# EAGLE design wiringshield2 (EAGLE 5.11)
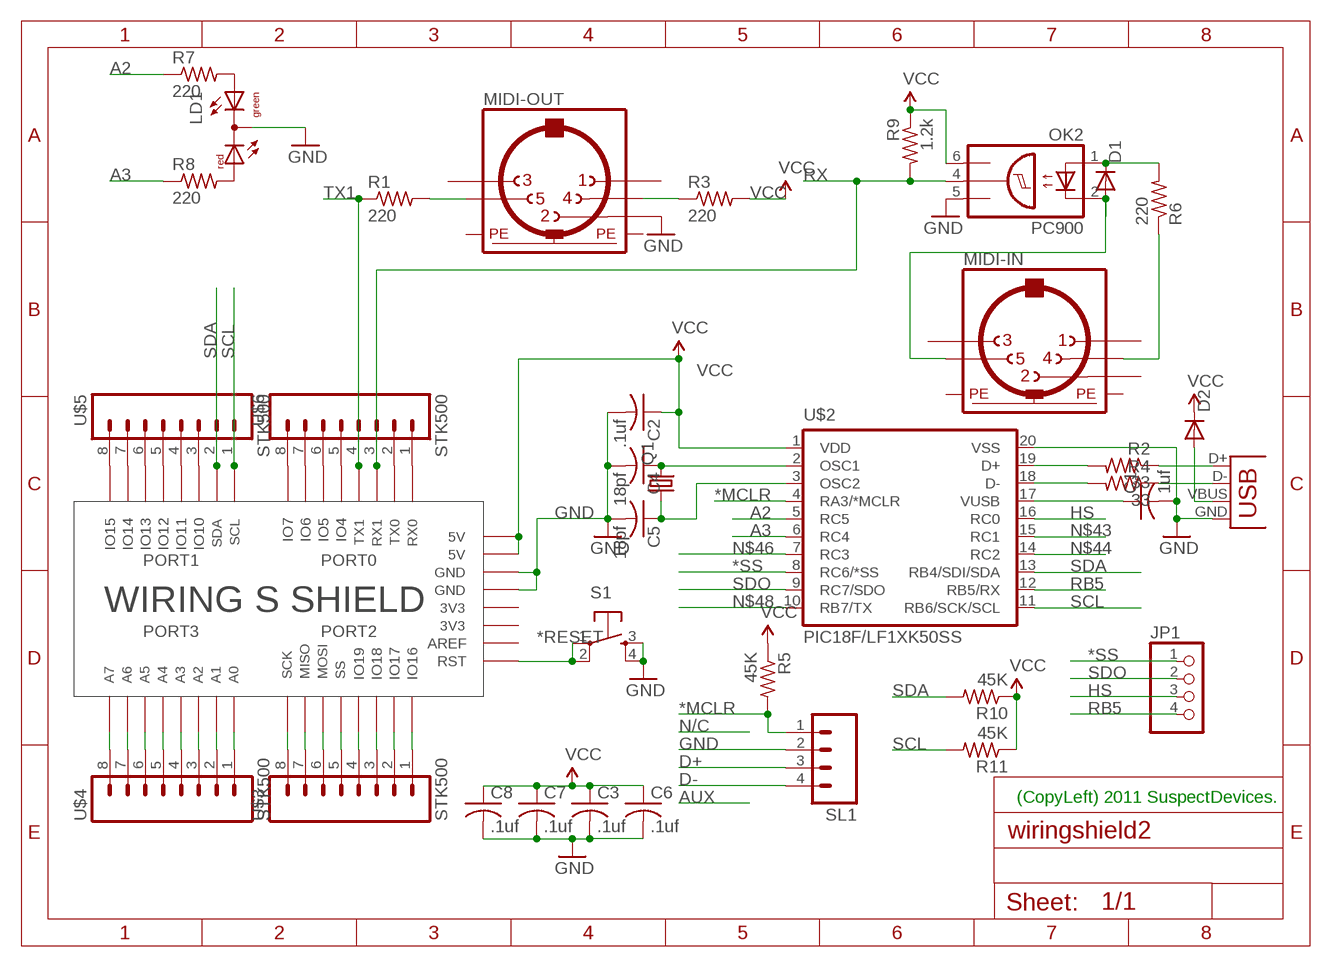
[diagram p0: schematic, sheet 1]

## Parts
C1  1uf  C-USC0603  [C0603]
C2  .1uf  C-USC0603  [C0603]
C3  .1uf  C-USC0603  [C0603]
C4  18pf  C-USC0603  [C0603]
C5  18pf  C-USC0603  [C0603]
C6  .1uf  C-USC0603  [C0603]
C7  .1uf  C-USC0603  [C0603]
C8  .1uf  C-USC0603  [C0603]
D1  DIODEPTH2  [DOIDE-1N4148]
D2  DIODEPTH2  [DOIDE-1N4148]
JP1  PINHD-1X4  [1X04]
LD1  DUOLED-RG-C  [DUOLED-C-5MM]
MIDI-IN  MAB5SH  [MAB5SH]
MIDI-OUT  MAB5SH  [MAB5SH]
OK2  PC900  OPI8013  [DIL06]
Q1  CRYSTALHC49S  [HC49/S]
R1  220  R-US_R0603  [R0603]
R2  33  R-US_R0603  [R0603]
R3  220  R-US_R0603  [R0603]
R4  33  R-US_R0603  [R0603]
R5  45K  R-US_R0603  [R0603]
R6  220  R-US_R0603  [R0603]
R7  220  R-US_R0603  [R0603]
R8  220  R-US_R0603  [R0603]
R9  1.2k  R-US_R0603  [R0603]
R10  45K  R-US_R0603  [R0603]
R11  45K  R-US_R0603  [R0603]
S1  TAC_SWITCHPTH  [TACTILE-PTH]
SL1  M04  [04P]
U$1  WIRINGSHIELD  [WIRINGSHIELD]
U$2  PIC18F/LF1XK50SS  [SSOP20]
U$3  STK500  [2X5-SHROUDED]
U$4  STK500  [2X5-SHROUDED]
U$5  STK500  [2X5-SHROUDED]
U$6  STK500  [2X5-SHROUDED]
X3  USB-3DPTH  [USB-B-PTH]

## Nets
*MCLR: R5.2 SL1.1 U$2.4(RA3/*MCLR)
*RESET: S1.1 S1.2 U$1.P$40(RST)
*SS: JP1.1 U$2.8(RC6/*SS)
A2: R7.1 U$2.5(RC5)
A3: R8.1 U$2.6(RC4)
D+: R2.2 SL1.3 U$2.19(D+)
D-: R4.2 SL1.4 U$2.18(D-)
GND [vcc]: C1.2 C2.2 C3.2 C4.2 C5.2 C6.2 C7.2 C8.2 LD1.C MIDI-OUT.2 OK2.5(GND) S1.3 S1.4 SL1.2 U$1.P$35(GND) U$1.P$36(GND) U$2.20(VSS) X3.GND
HS: JP1.3 U$2.16(RC0)
N$1: MIDI-OUT.5 R1.2
N$2: MIDI-OUT.4 R3.1
N$3: C1.1 U$2.17(VUSB)
N$4: U$1.P$17(IO16) U$3.1
N$5: U$1.P$18(IO17) U$3.2
N$6: LD1.AX(AG) R7.2
N$7: R2.1 X3.D+
N$8: R4.1 X3.D-
N$9: D2.A X3.VBUS
N$10: D1.C OK2.1(A) R6.2
N$11: U$1.P$19(IO18) U$3.3
N$12: U$1.P$20(IO19) U$3.4
N$13: U$1.P$21(IO20) U$3.5
N$14: C4.1 Q1.2 U$2.2(OSC1)
N$15: C5.1 Q1.1 U$2.3(OSC2)
N$16: MIDI-IN.4 R6.1
N$17: D1.A MIDI-IN.5 OK2.2(C)
N$19: U$1.P$22(IO21) U$3.6
N$20: U$1.P$23(IO22) U$3.7
N$21: U$1.P$24(IO23) U$3.8
N$22: U$1.P$25(IO24) U$4.1
N$23: U$1.P$26(IO25) U$4.2
N$24: U$1.P$27(IO26) U$4.3
N$25: U$1.P$28(IO27) U$4.4
N$26: U$1.P$29(IO28) U$4.5
N$27: U$1.P$30(IO29) U$4.6
N$28: U$1.P$31(IO30) U$4.7
N$29: U$1.P$32(IO31) U$4.8
N$30: LD1.AR R8.2
N$31: U$1.P$11(IO10) U$5.3
N$32: U$1.P$12(IO11) U$5.4
N$33: U$1.P$13(IO12) U$5.5
N$34: U$1.P$14(IO13) U$5.6
N$35: U$1.P$15(IO14) U$5.7
N$36: U$1.P$16(IO15) U$5.8
N$37: U$1.P$1(IO0) U$6.1
N$38: U$1.P$2(IO1) U$6.2
N$39: U$1.P$5(IO4) U$6.5
N$40: U$1.P$6(IO5) U$6.6
N$41: U$1.P$7(IO6) U$6.7
N$42: U$1.P$8(IO7) U$6.8
N$43: U$2.15(RC1)
N$44: U$2.14(RC2)
N$46: U$2.7(RC3)
N$48: U$2.10(RB7/TX)
RB5: JP1.4 U$2.12(RB5/RX)
RX: OK2.4(OUT) R9.2 U$1.P$3(IO2) U$6.3
SCL: R11.2 U$1.P$9(IO8) U$2.11(RB6/SCK/SCL) U$5.1
SDA: R10.2 U$1.P$10(IO9) U$2.13(RB4/SDI/SDA) U$5.2
SDO: JP1.2 U$2.9(RC7/SDO)
TX1: R1.1 U$1.P$4(IO3) U$6.4
VCC: C2.1 C3.1 C6.1 C7.1 C8.1 D2.C OK2.6(VCC) R3.2 R5.1 R9.1 R10.1 R11.1 U$1.P$33(5V) U$1.P$34(5V) U$2.1(VDD)
Unconnected: MIDI-IN.1 MIDI-IN.2 MIDI-IN.3 MIDI-IN.PE MIDI-IN.PE@(PE) MIDI-OUT.1 MIDI-OUT.3 MIDI-OUT.PE MIDI-OUT.PE@(PE) U$1.P$39(AREF)

## Notes on the sheet
- (CopyLeft) 2011 SuspectDevices.

## Power pins joined to a net without a drawn wire
3V3: U$1.P$37(3V3) U$1.P$38(3V3)
GND: U$3.9(GND) U$4.9(GND) U$5.9(GND) U$6.9(GND)
VCC: U$3.10(VCC) U$4.10(VCC) U$5.10(VCC) U$6.10(VCC)

## Library data of the parts
C1-C8 = rcl:C-US: CAPACITOR, American symbol
D1 D2 = 3d:DIODE: Diode These are standard reverse protection diodes and small signal diodes. SMA package can handle up to about 1A. SOD-323 can handle about 200mA. What the SOD-323 package when ordering, there are some mfgs out there that are 5-pin packages.
JP1 = 3d2011:PINHD-1X4: PIN HEADER
LD1 = led:DUOLED-RG-C: DUO LED 2 colors (red/green), 5 mm, round, common Cathode www.ligitek.com or other producers.
MIDI-IN MIDI-OUT = 3d2010:MAB5SH: Female CONNECTOR 5 pins 90 deg. with shield, horizontal (DIN 41524)
OK2 = optocoupler:OPI8013: OPTO COUPLER; OC_FARNELL: unknown; OC_NEWARK: unknown
Q1 = crystal:CRYSTAL: CRYSTAL; OC_FARNELL: 1667008; OC_NEWARK: unknown
R1 R3 R5 R7 R8 R10 R11 = resistor:R-US_: RESISTOR, American symbol
R2 R4 R6 R9 = rcl:R-US_: RESISTOR, American symbol
S1 = 3d2011:TAC_SWITCH: Momentary Switch Button commonly used for reset or general input. Spark Fun Electronics SKU : COM-00097
SL1 = con-amp-quick:M04: AMP QUICK CONNECTOR; OC_FARNELL: unknown; OC_NEWARK: unknown
U$1 = 3d2011:WIRINGSHIELD: Wiring S Shield
U$2 = mcp2200plus:PIC18F/LF1XK50: 20 pin USB flash Microcontroller.
U$3-U$6 = 3d2011:STK500
X3 = 3d2010:USB-3D: USB Connectors USB-B-PTH is fully proven SKU : PRT-00139 USB-miniB is fully proven SKU : PRT-00587 USB-A-PCB is untested. USB-A-H is throughly reviewed, but untested. Spark Fun Electronics SKU : PRT-00437 USB-B-SMT is throughly reviewed, but untested. Needs silkscreen touching up. USB-A-S has not been used/tested USB-MB-H has not been used/tested

## Net classes
0 default: width 0.203 mm
1 vcc: width 0.254 mm

## Board
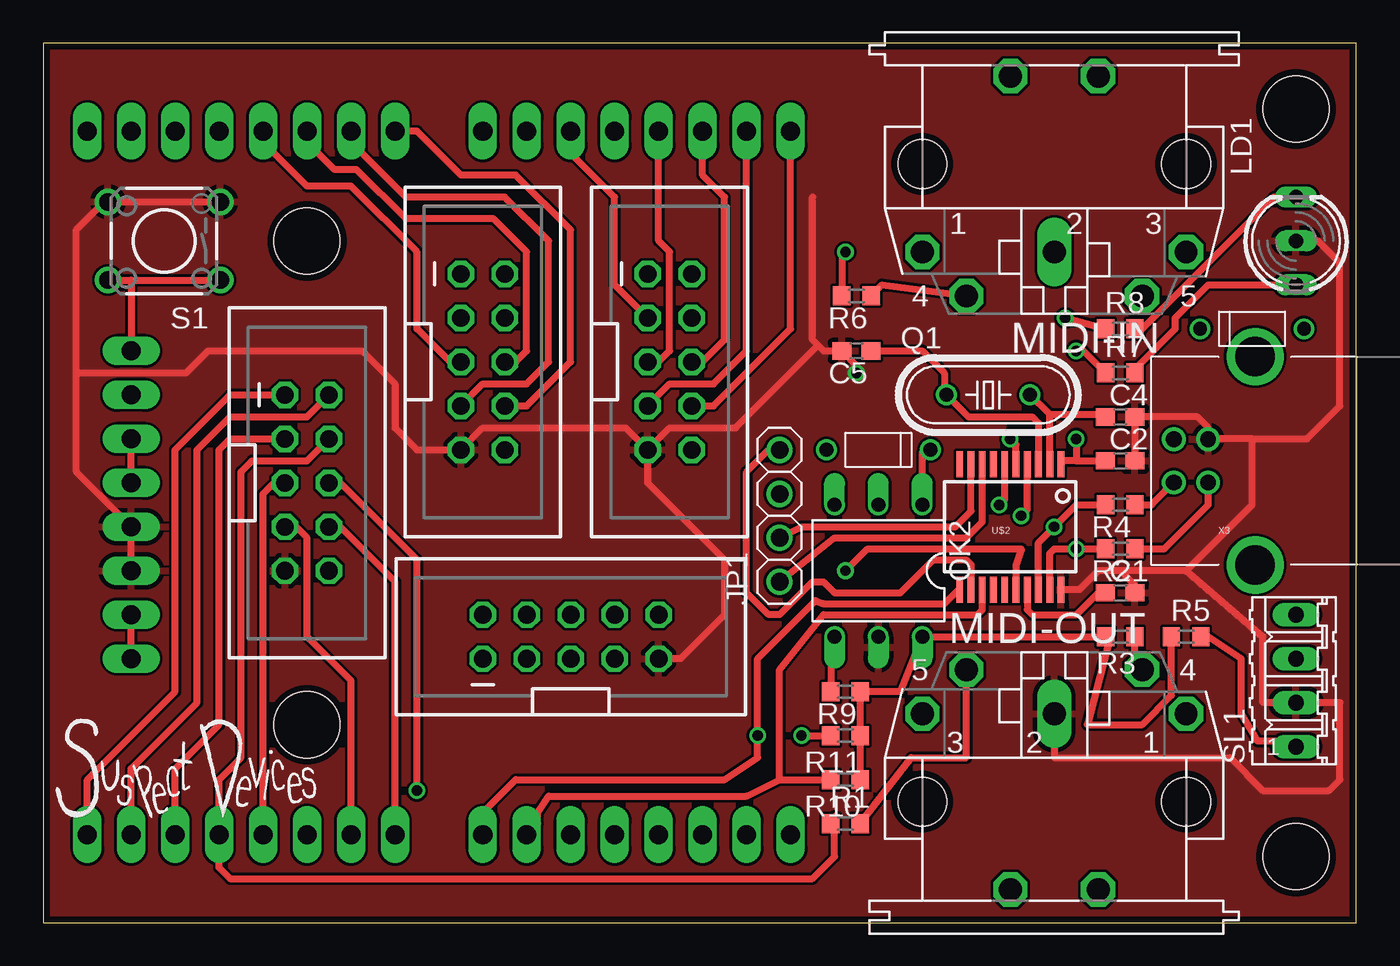
[diagram p1: board, top side]
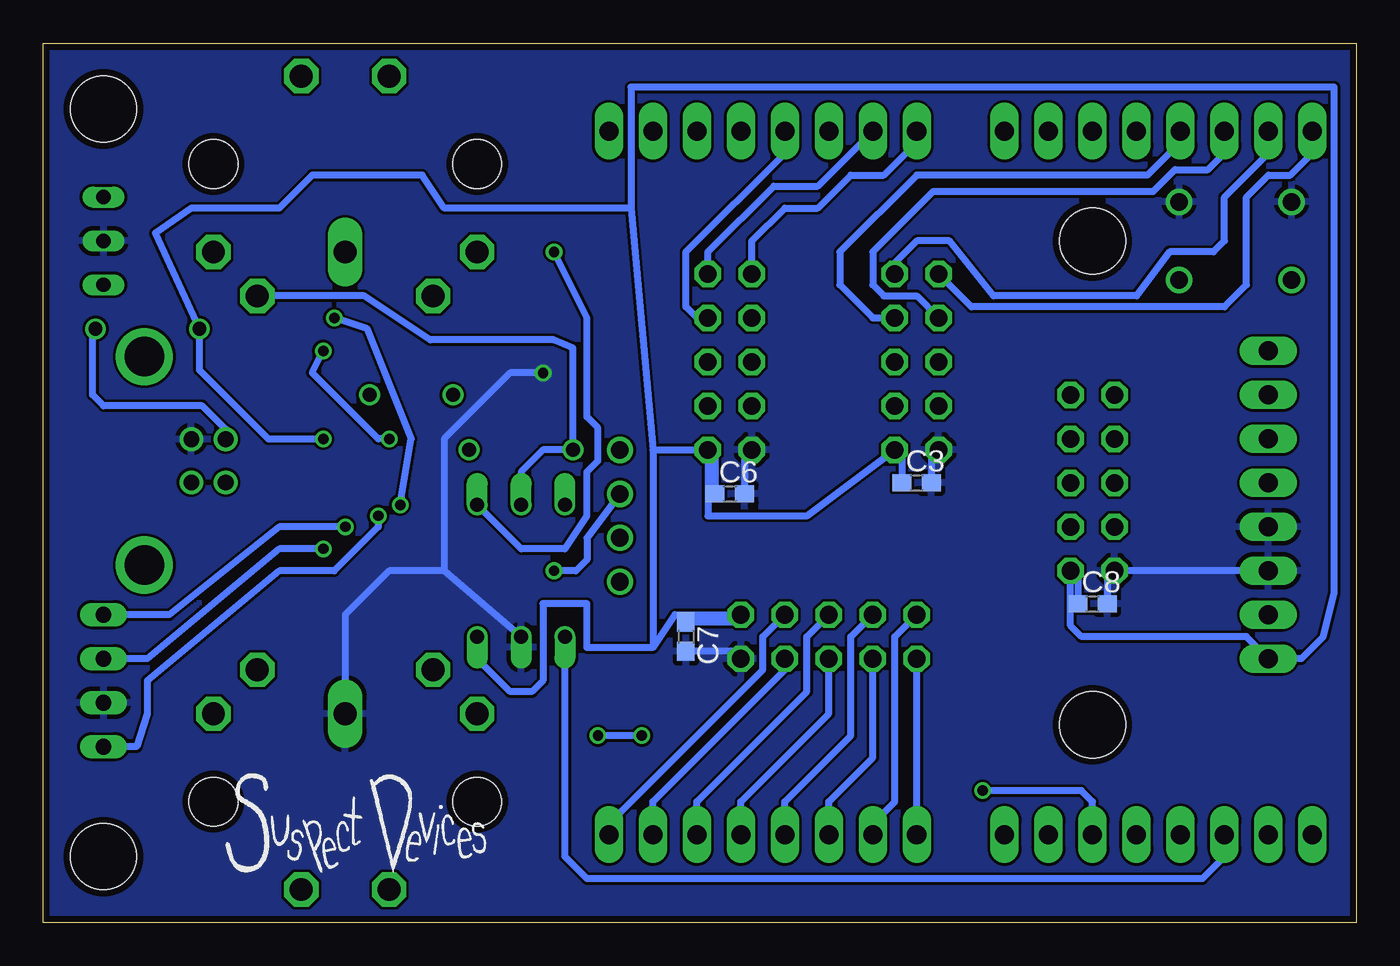
[diagram p2: board, bottom side, seen from below]

Size 75.87 x 50.79 mm. Coordinates in mm from the lower left corner, seen from the top.
Outline: 0,0 75.87,0 75.87,50.79 0,50.79 0,0
Copper layers (1*16): Top 0.0356mm / dielectric 1.5011mm / Bottom 0.0356mm
Design rules "LaenPCBOrder": minimum track width 6mil, minimum drill 13mil, track to track 6mil, track to pad 6mil, pad to pad 6mil, via to via 6mil, smd to smd 6mil, copper to edge 15mil, drill to drill 6mil, minimum pad ring 7mil, minimum via ring 7mil, stop-mask expansion 4mil, vias tented up to drill 0mil, thermal gap 10mil

### Footprints (pad centres in the part's own frame; a part is rotated, then mirrored left to right if it is on the bottom)
C0603 = smd 1.1 x 1: 1 -0.85,0; 2 0.85,0
DOIDE-1N4148 = drill 0.8 round: A 3,0; C -3,0
1X04 = drill 1.016 round: 1 -3.81,0; 2 -1.27,0; 3 1.27,0; 4 3.81,0
DUOLED-C-5MM = drill 0.813 long: AR 2.54,0; AX -2.54,0; C 0,0
MAB5SH = drill 1.321 octagon: 1 7.62,5.08; 3 -7.62,5.08; 4 5.08,7.62; 5 -5.08,7.62; PE -2.54,-5.08; PE@ 2.54,-5.08 | drill 1.321 long: 2 0,5.08 | hole 2.794: 7.62,0; -7.62,0
DIL06 = drill 0.813 offset: 1 -2.54,-3.81; 2 0,-3.81; 3 2.54,-3.81; 4 2.54,3.81; 5 0,3.81; 6 -2.54,3.81
HC49/S = drill 0.813 round: 1 -2.413,0; 2 2.413,0
R0603 = smd 1 x 1.1: 1 -0.85,0; 2 0.85,0
TACTILE-PTH = drill 1.016 round: 1 -3.251,2.261; 2 3.251,2.261; 3 -3.251,-2.261; 4 3.251,-2.261
04P = drill 0.914 long: 1 -3.81,0; 2 -1.27,0; 3 1.27,0; 4 3.81,0
WIRINGSHIELD = drill 1.1 pad 1.422 long: P$1 2.54,5.08; P$2 5.08,5.08; P$3 7.62,5.08; P$4 10.16,5.08; P$5 12.7,5.08; P$6 15.24,5.08; P$7 17.78,5.08; P$8 20.32,5.08; P$9 25.4,5.08; P$10 27.94,5.08; P$11 30.48,5.08; P$12 33.02,5.08; P$13 35.56,5.08; P$14 38.1,5.08; P$15 40.64,5.08; P$16 43.18,5.08; P$17 2.54,45.72; P$18 5.08,45.72; P$19 7.62,45.72; P$20 10.16,45.72; P$21 12.7,45.72; P$22 15.24,45.72; P$23 17.78,45.72; P$24 20.32,45.72; P$25 25.4,45.72; P$26 27.94,45.72; P$27 30.48,45.72; P$28 33.02,45.72; P$29 35.56,45.72; P$30 38.1,45.72; P$31 40.64,45.72; P$32 43.18,45.72; P$33 5.08,15.24; P$34 5.08,17.78; P$35 5.08,20.32; P$36 5.08,22.86; P$37 5.08,25.4; P$38 5.08,27.94; P$39 5.08,30.48; P$40 5.08,33.02 | hole 3.81: 15.24,11.43; 15.24,39.37; 72.39,46.99; 72.39,3.81
SSOP20 = smd 0.4 x 1.5: 1 -2.925,-3.625; 2 -2.275,-3.625; 3 -1.625,-3.625; 4 -0.975,-3.625; 5 -0.325,-3.625; 6 0.325,-3.625; 7 0.975,-3.625; 8 1.625,-3.625; 9 2.275,-3.625; 10 2.925,-3.625; 11 2.925,3.625; 12 2.275,3.625; 13 1.625,3.625; 14 0.975,3.625; 15 0.325,3.625; 16 -0.325,3.625; 17 -0.975,3.625; 18 -1.625,3.625; 19 -2.275,3.625; 20 -2.925,3.625
2X5-SHROUDED = drill 1.016 octagon: 1 -1.27,5.08; 2 1.27,5.08; 3 -1.27,2.54; 4 1.27,2.54; 5 -1.27,0; 6 1.27,0; 7 -1.27,-2.54; 8 1.27,-2.54; 9 -1.27,-5.08; 10 1.27,-5.08
USB-B-PTH = drill 0.914 round: D+ 0,1.25; D- 1.981,1.25; GND 0,-1.25; VBUS 1.981,-1.25 | drill 2.286 round: P$1 -2.718,-6.02; P$2 -2.718,6.02

### Placement (x,y rotation side)
C1  62.23,19.05 0 top
C2  62.23,26.67 0 top
C3  25.4,25.4 0 bottom
C4  62.23,29.21 0 top
C5  46.99,33.02 180 top
C6  36.2,24.77 0 bottom
C7  38.73,16.51 270 bottom
C8  15.24,18.41 0 bottom
D1  48.26,27.3 180 top
D2  69.85,34.29 0 top
JP1  42.55,23.5 90 top
LD1  72.39,39.37 90 top
MIDI-IN  58.42,43.81 180 top
MIDI-OUT  58.42,6.99 0 top
OK2  48.26,20.32 180 top
Q1  54.61,30.48 0 top
R1  46.35,5.71 0 top
R2  62.23,21.59 180 top
R3  62.23,16.51 180 top
R4  62.23,24.13 180 top
R5  66.04,16.51 0 top
R6  46.99,36.2 180 top
R7  62.23,31.75 0 top
R8  62.23,34.29 0 top
R9  46.35,13.34 180 top
R10  46.35,8.26 180 top
R11  46.35,10.79 180 top
S1  6.99,39.37 180 top
SL1  72.39,13.97 90 top
U$1  0,0 0 top
U$2  55.88,22.86 180 top
U$3  25.4,32.38 0 top
U$4  36.2,32.38 0 top
U$5  30.48,16.51 90 top
U$6  15.24,25.4 0 top
U$7  [SUSDEVLOGOSM]  0.64,6.35 0 top
U$8  [SUSDEVLOGOSM]  65.41,3.17 0 bottom
X3  67.31,26.67 180 top

### Tracks (layer width: path | path; a pad name or v marks a point on that pad's centre or on a via)
3V3
  Top 0.406: U$1.P$37 U$1.P$38
*MCLR  (via drill 0.6)
  Top 0.406: U$2.4 56.85,23.84 v56.52,23.5 | R5.2 67.31,16.51 69.22,15.24 69.22,12.06 70.17,10.48 72.07,10.48 SL1.1
  Bottom 0.406: v56.52,23.5 56.52,22.86 59.05,20.32 62.23,20.32 69.85,13.97 69.85,12.06 70.48,10.16 SL1.1
*RESET
  Top 0.406: S1.2 5.08,37.11 | 5.08,37.11 S1.1 | 5.08,37.11 U$1.P$40
*SS
  Top 0.406: U$2.8 54.26,23.14 53.34,22.23 45.72,22.23 JP1.1
A2  (via drill 0.6)
  Top 0.406: U$2.5 56.2,27.61 v55.88,27.94 | v59.69,33.02 60.11,33.02 R7.1
  Bottom 0.406: v55.88,27.94 56.52,27.94 60.33,31.75 v59.69,33.02
A3  (via drill 0.6)
  Top 0.406: U$2.6 55.55,24.44 v55.24,24.13 | v59.05,34.92 R8.1
  Bottom 0.406: v55.24,24.13 54.61,27.94 57.15,34.29 v59.05,34.92
D+  (via drill 0.6)
  Top 0.406: U$2.19 58.16,21.32 58.42,21.59 v59.69,21.59 R2.2
  Bottom 0.406: v59.69,21.59 62.23,21.59 69.85,15.24 SL1.3
D-  (via drill 0.6)
  Top 0.406: U$2.18 57.51,21.95 v58.42,22.86 59.69,24.13 R4.2
  Bottom 0.406: v58.42,22.86 62.23,22.86 68.58,17.78 SL1.4
GND  (via drill 0.6)
  Top 0.406: U$2.20 59.88,19.23 60.96,20.32 62.23,20.32 | C1.2 63.08,19.47 62.23,20.32 | 66.04,20.32 62.23,20.32 | 66.04,20.32 69.85,24.13 69.85,27.94 | 69.85,27.94 67.33,27.94 X3.GND 67.31,28.57 66.67,29.21 C4.2 C2.2 | 66.04,20.32 70.48,16.51 70.48,12.7 SL1.2 74.93,12.7 74.93,8.26 74.3,7.62 70.48,7.62 68.58,9.53 58.42,9.53 MIDI-OUT.2 | 69.85,27.94 73.03,27.94 74.93,29.84 74.93,38.1 73.66,39.37 LD1.C | 44.77,33.34 45.09,33.02 C5.2 46.99,32.17 v46.99,31.75 | 44.77,33.34 44.45,33.66 44.45,41.91 | S1.3 S1.4 3.53,41.63 1.91,40.01 1.91,31.75 | 1.91,31.75 1.91,26.04 U$1.P$36 U$1.P$35 | 1.91,31.75 8.26,31.75 9.53,33.02 18.41,33.02 20.32,31.11 20.32,28.57 21.59,27.3 U$3.9 25.4,28.57 33.66,28.57 U$4.9 | U$4.9 36.2,28.57 40.01,28.57 44.77,33.34 | U$4.9 34.92,25.4 39.37,20.95 39.37,17.78 36.83,15.24 U$5.9
  Bottom 0.406: 52.7,20.32 OK2.5 | MIDI-OUT.2 58.42,17.78 55.88,20.32 52.7,20.32 | U$1.P$35 U$6.9 14.39,19.9 C8.2 | C6.2 35.34,26.89 U$4.9 | C3.2 24.55,26.89 U$3.9 | C7.2 35.98,15.66 U$5.9 | 52.7,20.32 52.7,27.94 48.9,31.75 v46.99,31.75
  pour Top: 0,0 76.2,0 76.2,50.8 0,50.8
  pour Bottom: 0,0 76.2,0 76.2,50.8 0,50.8
HS  (via drill 0.6)
  Top 0.406: U$2.16 56.2,20.63 56.52,21.59 47.62,21.59 v46.35,20.32
  Bottom 0.406: v46.35,20.32 45.09,20.32 44.45,20.95 44.45,22.23 JP1.3
N$1
  Top 0.406: R1.2 50.16,9.53 53.34,9.53 MIDI-OUT.5
N$2
  Top 0.406: R3.1 63.08,14.39 MIDI-OUT.4
N$3
  Top 0.406: C1.1 60.96,19.05 59.69,17.78 57.15,17.78 56.85,18.07 U$2.17
N$4
  Bottom 0.406: U$1.P$17 2.54,44.45 3.81,43.18 5.08,43.18 6.35,41.91 6.35,36.83 7.62,35.56 22.23,35.56 U$3.1
N$5
  Bottom 0.406: U$1.P$18 5.08,44.45 7.62,41.91 7.62,39.37 8.26,38.73 10.79,38.73 12.7,36.2 20.95,36.2 23.5,39.37 25.4,39.37 26.67,38.1 U$3.2
N$6
  Top 0.406: R7.2 63.08,31.96 65.41,34.29 65.41,34.92 67.31,36.83 LD1.AX
N$7
  Top 0.406: X3.D+ 67.31,24.13 64.77,21.59 R2.1
N$8
  Top 0.406: R4.1 64.04,24.13 X3.D-
N$9
  Bottom 0.406: X3.VBUS 65.33,28.5 66.67,29.84 72.39,29.84 73.03,30.48 73.03,34.12 D2.A
N$10  (via drill 0.6)
  Top 0.406: R6.2 46.14,38.52 v46.35,38.73 | OK2.1 50.8,27.13 D1.C
  Bottom 0.406: v46.35,38.73 44.45,34.92 44.45,29.21 43.81,28.57 43.81,26.67 44.45,26.04 44.45,23.5 45.72,21.59 48.26,21.59 OK2.1
N$11
  Bottom 0.406: U$1.P$19 7.62,44.45 8.57,43.5 10.48,43.5 11.75,42.23 24.45,42.23 27.94,38.73 27.94,36.83 27.3,36.2 25.4,36.2 U$3.3
N$12
  Bottom 0.406: U$1.P$20 10.16,45.09 12.06,43.18 25.4,43.18 29.84,38.73 29.84,36.83 27.94,34.92 U$3.4
N$13
  Top 0.406: U$1.P$21 12.7,45.09 15.24,42.55 17.78,42.55 21.59,38.73 21.59,34.29 23.5,32.38 U$3.5
N$14
  Top 0.406: U$2.2 58.16,29.35 | 58.16,29.35 Q1.2 | 58.16,29.35 61.24,29.35 C4.1
N$15
  Top 0.406: U$2.3 57.51,28.86 57.15,29.21 53.47,29.21 Q1.1 52.07,30.61 52.07,31.75 50.8,33.02 C5.1
N$16
  Top 0.406: MIDI-IN.4 48.48,36.83 R6.1
N$17
  Bottom 0.406: MIDI-IN.5 57.33,36.2 53.52,33.66 46.35,33.66 45.26,33.2 D1.A 46.99,27.3 48.26,26.04 OK2.2
N$19
  Top 0.406: U$1.P$22 15.24,45.09 16.83,43.5 18.1,43.5 20.95,40.64 26.04,40.64 27.94,38.73 27.94,33.02 27.3,32.38 U$3.6
N$20
  Top 0.406: U$1.P$23 17.78,45.09 20.95,41.91 26.67,41.91 29.21,39.37 29.21,32.38 27.94,31.11 25.4,31.11 U$3.7
N$21
  Top 0.406: U$1.P$24 21.59,45.72 24.13,43.18 27.3,43.18 30.48,40.01 30.48,32.38 27.94,29.84 U$3.8
N$22
  Bottom 0.406: U$1.P$25 25.4,45.09 27.3,43.18 29.21,43.18 31.11,41.27 33.02,41.27 34.92,39.37 U$4.1
N$23
  Bottom 0.406: U$1.P$26 31.11,42.55 33.66,42.55 37.47,38.73 U$4.2
N$24
  Top 0.406: U$1.P$27 30.48,44.45 33.02,41.91 33.02,36.83 U$4.3
N$25
  Bottom 0.406: U$1.P$28 33.02,44.45 38.73,38.73 38.73,35.56 38.1,34.92 U$4.4
N$26
  Top 0.406: U$1.P$29 35.56,39.37 36.2,38.73 36.2,33.02 35.56,32.38 U$4.5
N$27
  Top 0.406: U$1.P$30 38.1,43.18 39.37,41.91 39.37,33.66 38.1,32.38 U$4.6
N$28
  Top 0.406: U$1.P$31 40.64,33.02 38.73,31.11 36.2,31.11 U$4.7
N$29
  Top 0.406: U$1.P$32 43.18,34.29 38.73,29.84 U$4.8
N$30
  Top 0.406: R8.2 63.5,34.29 71.12,41.91 LD1.AR
N$31
  Bottom 0.406: U$5.3 27.94,9.53 30.48,6.99 U$1.P$11
N$32
  Bottom 0.406: U$5.4 29.21,16.51 29.21,10.79 33.02,6.99 U$1.P$12
N$33
  Bottom 0.406: U$5.5 30.48,12.06 35.56,6.99 U$1.P$13
N$34
  Bottom 0.406: U$5.6 31.75,16.51 31.75,13.34 38.1,6.99 U$1.P$14
N$35
  Bottom 0.406: U$5.7 33.02,14.61 40.64,6.99 U$1.P$15
N$36
  Bottom 0.406: U$5.8 34.29,16.51 34.29,14.61 43.18,5.71 U$1.P$16
N$37
  Top 0.406: U$6.1 10.79,30.48 7.62,27.3 7.62,13.34 2.54,8.26 U$1.P$1
N$38
  Top 0.406: U$6.2 15.24,29.21 10.79,29.21 8.89,27.3 8.89,12.7 5.08,8.89 U$1.P$2
N$39
  Top 0.406: U$6.5 13.34,25.4 12.7,24.77 U$1.P$5
N$40  (via drill 0.6)
  Top 0.406: U$6.6 17.14,25.4 21.59,20.95 v21.59,7.62
  Bottom 0.406: v21.59,7.62 15.88,7.62 15.24,6.99 U$1.P$6
N$41
  Top 0.406: U$6.7 14.61,22.86 15.24,22.23 15.24,16.51 17.78,13.97 U$1.P$7
N$42
  Top 0.406: U$6.8 17.14,22.86 20.32,19.68 U$1.P$8
RB5
  Top 0.406: JP1.4 41.91,27.3 40.64,26.04 40.64,19.05 41.91,17.78 42.55,17.78 44.45,19.68 45.09,19.68 45.72,19.05 49.53,19.05 51.44,20.95 53.34,20.95 53.6,20.69 U$2.12
RX
  Top 0.406: R9.2 45.51,15.66 OK2.4 | U$6.3 10.79,27.94 10.16,27.3 10.16,11.43 7.62,8.89 U$1.P$3
  Bottom 0.406: U$1.P$3 7.62,3.81 8.89,2.54 44.45,2.54 45.72,3.81 OK2.4
SCL  (via drill 0.6)
  Top 0.406: U$2.11 52.89,19.23 52.07,18.41 45.09,18.41 44.63,18.6 41.27,15.24 v41.27,10.79 41.27,9.53 39.37,8.26 27.3,8.26 25.4,6.35 U$1.P$9 | v43.81,10.79 R11.2
  Bottom 0.406: v41.27,10.79 v43.81,10.79 | U$1.P$9 U$5.1
SDA
  Top 0.406: U$2.13 54.26,18.06 53.98,17.78 45.09,17.78 42.55,14.61 42.55,8.26 | 42.55,8.26 40.64,7.3 29.21,7.3 28.57,6.35 28.57,5.71 U$1.P$10 | 42.55,8.26 R10.2
  Bottom 0.406: U$5.2 26.67,16.51 26.67,6.99 27.94,5.71 U$1.P$10
SDO
  Top 0.406: U$2.9 53.6,23.76 52.7,22.86 43.81,22.86 JP1.2
TX1
  Top 0.406: R1.1 45.72,6.13 45.72,3.81 44.45,2.54 10.79,2.54 10.16,3.17 U$1.P$4 10.16,8.26 11.43,9.53 11.43,26.04 12.06,26.67 15.24,26.67 U$6.4
VCC  (via drill 0.6)
  Top 0.406: R5.1 65.19,13.12 63.5,11.43 60.33,11.43 61.59,16.3 R3.2 OK2.6 49.53,13.34 R9.1 R11.1 R10.1 | 59.69,26.67 58.99,26.67 U$2.1 | 59.69,26.67 C2.1 | v59.69,27.94 59.69,26.67 | U$1.P$33 U$1.P$34
  Bottom 0.406: v59.69,27.94 62.87,27.94 66.85,31.93 D2.C 69.39,39.83 67.31,41.27 62.23,41.27 60.33,43.18 53.98,43.18 52.7,41.27 41.91,41.27 | 41.91,41.27 41.91,48.26 1.27,48.26 1.27,19.05 1.91,16.51 3.17,15.24 U$1.P$33 6.35,16.51 15.88,16.51 16.51,17.14 U$6.10 16.09,19.9 C8.1 | 41.91,41.27 40.64,27.3 | 40.64,27.3 40.64,15.88 | 40.64,15.88 39.37,17.78 U$5.10 35.98,17.36 C7.1 | OK2.6 50.8,15.24 48.9,13.34 47.62,13.34 46.99,13.97 46.99,18.41 44.45,18.41 44.45,15.88 40.64,15.88 | 40.64,27.3 U$4.10 | U$4.10 37.47,23.5 31.75,23.5 U$3.10 26.25,26.89 C3.1 | C6.1 37.05,26.89 U$4.10